# Altium schematic sheet logic.SchDoc
size A4
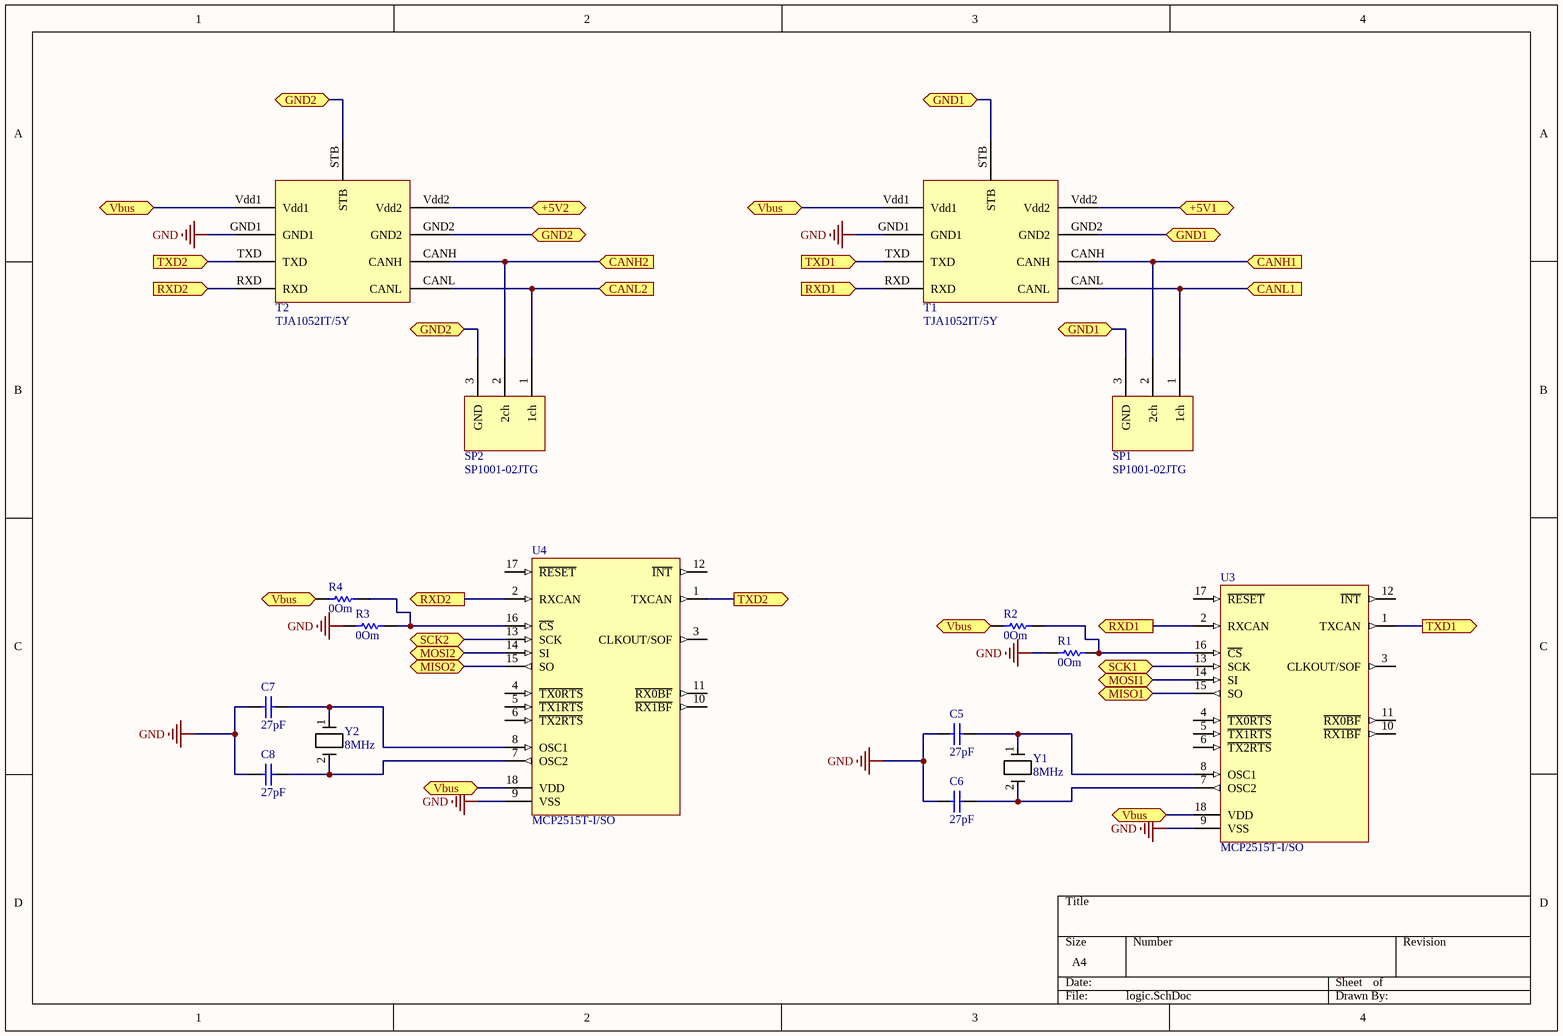
[diagram p0: logic.SchDoc]

## Parts
C5  27pF  [CAPC1608X90X35ML10T15]
C6  27pF  [CAPC1608X90X35ML10T15]
C7  27pF  [CAPC1608X90X35ML10T15]
C8  27pF  [CAPC1608X90X35ML10T15]
R1  0Om  [RESC1608X55X30ML20T10]
R2  0Om  [RESC1608X55X30ML20T10]
R3  0Om  [RESC1608X55X30ML20T10]
R4  0Om  [RESC1608X55X30ML20T10]
SP1  SP1001-02JTG  [SC70-3]
SP2  SP1001-02JTG  [SC70-3]
T1  TJA1052IT/5Y  [TJA1052]
T2  TJA1052IT/5Y  [TJA1052]
U3  MCP2515T-I/SO  [SOIC-SO18_N]
U4  MCP2515T-I/SO  [SOIC-SO18_N]
Y1  8MHz  [SMD-5032_2P]
Y2  8MHz  [SMD-5032_2P]

## Ports
+5V1 (bidir), +5V2 (bidir), CANH1 (in), CANH2 (in), CANL1 (in), CANL2 (in), GND1 (bidir), GND2 (bidir), MISO1 (bidir), MISO2 (bidir), MOSI1 (bidir), MOSI2 (bidir), RXD1 (in), RXD1 (out), RXD2 (in), RXD2 (out), SCK1 (bidir), SCK2 (bidir), TXD1 (in), TXD1 (out), TXD2 (in), TXD2 (out), Vbus (bidir)

## Nets
GND: C5.1 C6.1 C7.1 C8.1 R1.1 R3.1 T1.GND1 T2.GND1 U3.9(VSS) U4.9(VSS)
+5V1: T1.Vdd2 ; port +5V1
+5V2: T2.Vdd2 ; port +5V2
CANH1: SP1.2(2ch) T1.CANH ; port CANH1
CANH2: SP2.2(2ch) T2.CANH ; port CANH2
CANL1: SP1.1(1ch) T1.CANL ; port CANL1
CANL2: SP2.1(1ch) T2.CANL ; port CANL2
GND1: SP1.3(GND) T1.GND2 T1.STB ; port GND1
GND2: SP2.3(GND) T2.GND2 T2.STB ; port GND2
MISO1: U3.15(SO) ; port MISO1
MISO2: U4.15(SO) ; port MISO2
MOSI1: U3.14(SI) ; port MOSI1
MOSI2: U4.14(SI) ; port MOSI2
RXD1: T1.RXD U3.2(RXCAN) ; port RXD1
RXD2: T2.RXD U4.2(RXCAN) ; port RXD2
SCK1: U3.13(SCK) ; port SCK1
SCK2: U4.13(SCK) ; port SCK2
TXD1: T1.TXD U3.1(TXCAN) ; port TXD1
TXD2: T2.TXD U4.1(TXCAN) ; port TXD2
Vbus: R2.1 R4.1 T1.Vdd1 T2.Vdd1 U3.18(VDD) U4.18(VDD) ; port Vbus
NetC5_2: C5.2 U3.8(OSC1) Y1.1
NetC6_2: C6.2 U3.7(OSC2) Y1.2
NetC7_2: C7.2 U4.8(OSC1) Y2.1
NetC8_2: C8.2 U4.7(OSC2) Y2.2
NetR1_2: R1.2 R2.2 U3.16(~{CS})
NetR3_2: R3.2 R4.2 U4.16(~{CS})

Not connected (* = marked no-connect by the designer): U3 3(CLKOUT/SOF) 4(~{TX0RTS}) 5(~{TX1RTS}) 6(~{TX2RTS}) 10(~{RX1BF}) 11(~{RX0BF}) 12(~{INT}) 17(~{RESET}); U4 3(CLKOUT/SOF) 4(~{TX0RTS}) 5(~{TX1RTS}) 6(~{TX2RTS}) 10(~{RX1BF}) 11(~{RX0BF}) 12(~{INT}) 17(~{RESET})

## Library data of the parts
C5-C8 = CMP-2006-02335-1: Manufacturer: Murata; Part Number: GCM1885C2A101JA16D
R1-R4 = CMP-2000-01555-1: Part Number: RK73H1JTTD5101F; Manufacturer: KOA Speer
U3 U4 = CMP-0186-00139-2: Stand-Alone CAN Controller With SPI Interface, 18-Pin SOIC, Industrial Temperature, Tape and Reel; RevisionNote: URLs added. DatasheetVersion updated.; ComponentLink1Description: Manufacturer URL; Code_JEDEC: MS-013; ComponentLink2URL: http://ww1.microchip.com/downloads/en/DeviceDoc/21801f.pdf; ComponentLink3Description: Package Specification; PackageVersion: revBB, Aug-2009; PackageReference: SOIC-SO18; ComponentLink2Description: Datasheet; DatasheetVersion: revF, Oct-2010; PackageDescription: 18-Lead Plastic Small Outline (SO) - Wide 7.50mm Body [SOIC]; ComponentLink1URL: http://www.microchip.com/; ComponentLink3URL: http://www.microchip.com/stellent/groups/techpub_sg/documents/packagingspec/en012702.pdf
Y1 Y2 = SMD-5032_2P resonator
T1 T2 = TJA1052IT/5Y: ComponentLink1Description: New link; ComponentLink1URL: https://lcsc.com/product-detail/CAN-ICs_NXP-Semicon_TJA1052IT-5Y_NXP-Semicon-TJA1052IT-5Y_C92210.html